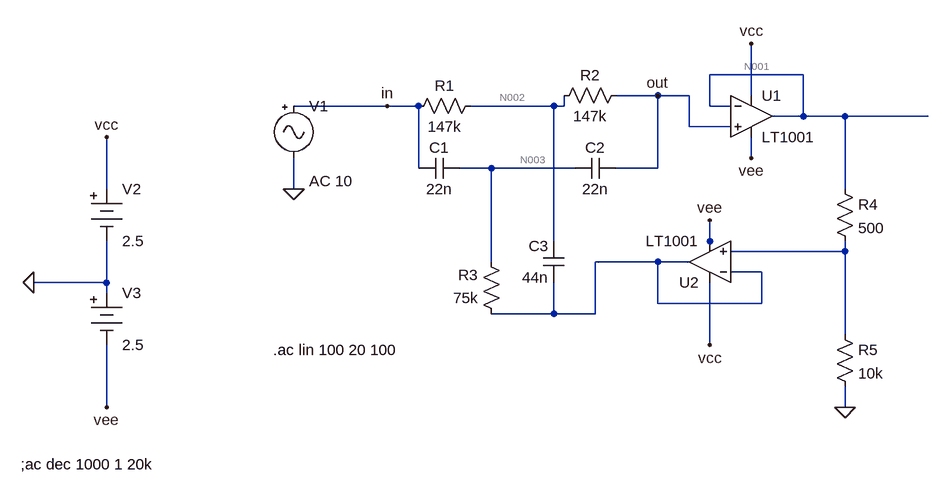
[diagram p0: schematic 50hz_filter.asc]
50hz_filter.asc, the LTspice schematic file:
Version 4
SHEET 1 880 680
WIRE 560 -64 416 -64
WIRE 336 -32 272 -32
WIRE 384 -32 336 -32
WIRE 480 -32 480 -112
WIRE -80 -16 -224 -16
WIRE -32 -16 -80 -16
WIRE 176 -16 48 -16
WIRE 192 -16 192 -32
WIRE 192 -16 176 -16
WIRE 416 -16 416 -64
WIRE 448 -16 416 -16
WIRE 560 0 560 -64
WIRE 560 0 512 0
WIRE 624 0 560 0
WIRE 752 0 624 0
WIRE 384 16 384 -32
WIRE 448 16 384 16
WIRE 480 64 480 32
WIRE -32 80 -32 -16
WIRE 80 80 32 80
WIRE 208 80 80 80
WIRE 336 80 336 -32
WIRE 336 80 272 80
WIRE -512 112 -512 32
WIRE -224 112 -224 64
WIRE 624 112 624 0
WIRE 176 192 176 -16
WIRE 416 192 416 160
WIRE 416 208 416 192
WIRE 624 208 624 192
WIRE 624 208 448 208
WIRE 80 224 80 80
WIRE 336 224 240 224
WIRE 384 224 336 224
WIRE 496 240 448 240
WIRE -512 256 -512 192
WIRE -512 256 -624 256
WIRE -512 272 -512 256
WIRE 336 288 336 224
WIRE 496 288 496 240
WIRE 496 288 336 288
WIRE 176 304 176 256
WIRE 176 304 80 304
WIRE 240 304 240 224
WIRE 240 304 176 304
WIRE 624 336 624 208
WIRE 416 352 416 256
WIRE -512 448 -512 352
WIRE 624 448 624 416
FLAG -224 112 0
FLAG 336 -32 out
FLAG -80 -16 in
FLAG 624 448 0
FLAG -512 32 vcc
FLAG -512 448 vee
FLAG -624 256 0
FLAG 480 -112 vcc
FLAG 416 352 vcc
FLAG 480 64 vee
FLAG 416 160 vee
SYMBOL res 64 -32 R90
WINDOW 0 0 56 VBottom 2
WINDOW 3 32 56 VTop 2
SYMATTR InstName R1
SYMATTR Value 147k
SYMBOL res 288 -48 R90
WINDOW 0 0 56 VBottom 2
WINDOW 3 32 56 VTop 2
SYMATTR InstName R2
SYMATTR Value 147k
SYMBOL res 96 320 R180
WINDOW 0 36 76 Left 2
WINDOW 3 36 40 Left 2
SYMATTR InstName R3
SYMATTR Value 75k
SYMBOL cap 32 64 R90
WINDOW 0 0 32 VBottom 2
WINDOW 3 32 32 VTop 2
SYMATTR InstName C1
SYMATTR Value 22n
SYMBOL cap 272 64 R90
WINDOW 0 0 32 VBottom 2
WINDOW 3 32 32 VTop 2
SYMATTR InstName C2
SYMATTR Value 22n
SYMBOL cap 192 256 R180
WINDOW 0 24 56 Left 2
WINDOW 3 24 8 Left 2
SYMATTR InstName C3
SYMATTR Value 44n
SYMBOL Misc\\signal -224 -32 R0
WINDOW 123 24 132 Left 2
WINDOW 39 0 0 Left 0
SYMATTR Value2 AC 10
SYMATTR InstName V1
SYMATTR Value ""
SYMBOL OpAmps\\LT1001 480 -64 R0
SYMATTR InstName U1
SYMBOL OpAmps\\LT1001 416 288 R180
SYMATTR InstName U2
SYMBOL res 608 96 R0
SYMATTR InstName R4
SYMATTR Value 500
SYMBOL res 608 320 R0
SYMATTR InstName R5
SYMATTR Value 10k
SYMBOL Misc\\battery -512 96 R0
WINDOW 123 0 0 Left 0
WINDOW 39 0 0 Left 0
SYMATTR InstName V2
SYMATTR Value 2.5
SYMBOL Misc\\battery -512 256 R0
WINDOW 123 0 0 Left 0
WINDOW 39 0 0 Left 0
SYMATTR InstName V3
SYMATTR Value 2.5
TEXT -256 360 Left 2 !.ac lin 100 20 100
TEXT -644 536 Left 2 !;ac dec 1000 1 20k

The netlist it stands for:
* 50hz_filter.asc
R1 N002 in 147k
R2 out N002 147k
R3 N005 N003 75k
C1 N003 in 22n
C2 out N003 22n
C3 N005 N002 44n
V1 in 0 AC 10
XU1 out N001 vcc vee N001 LT1001  ; pins In+ In- V+ V- OUT
XU2 N004 N005 vcc vee N005 LT1001  ; pins In+ In- V+ V- OUT
R4 N001 N004 500
R5 N004 0 10k
V2 vcc 0 2.5
V3 0 vee 2.5
.ac lin 100 20 100
;ac dec 1000 1 20k
.lib LTC.lib
.backanno
.end

* Results of the author's LTspice run, read from the files saved beside the schematic
* Operating Point, zero values left out:
*   V(vcc) = 2.5 V
*   V(vee) = -2.5 V
*   I(V3) = -4.5 mA
*   I(V2) = -4.5 mA
*   Ix(u1:3) = 2.25 mA
*   Ix(u1:4) = -2.25 mA
*   Ix(u2:3) = 2.25 mA
*   Ix(u2:4) = -2.25 mA
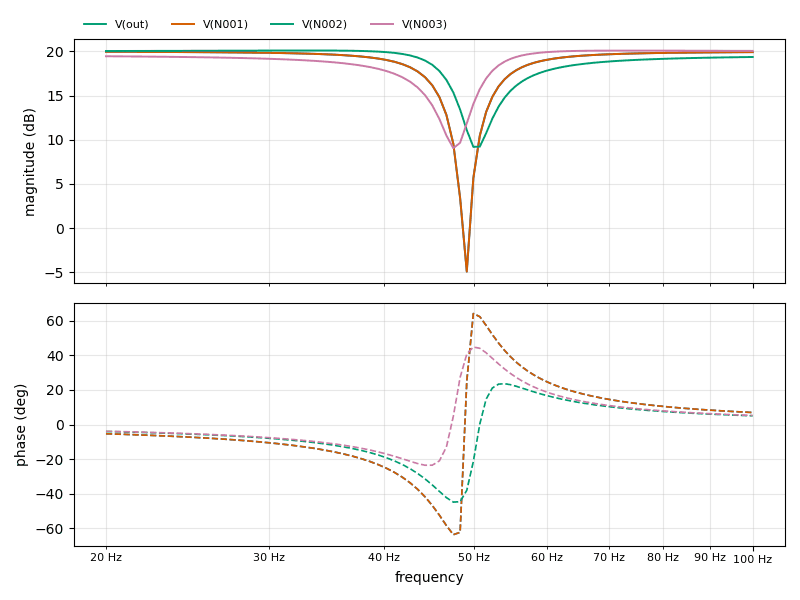
[diagram p1: AC Analysis of 50hz_filter.asc, plotted from the saved traces]
* AC Analysis, 1 run:
*   V(out): 19.96 dB at 20 Hz, 19.92 dB at 100 Hz, peak 19.96 dB at 20 Hz, 3 dB below the peak at 44.36 Hz
*   V(N001): 19.96 dB at 20 Hz, 19.92 dB at 100 Hz, peak 19.96 dB at 20 Hz, 3 dB below the peak at 44.36 Hz
*   V(N002): 20.05 dB at 20 Hz, 19.37 dB at 100 Hz, peak 20.10 dB at 32.93 Hz, 3 dB below the peak at 46.41 Hz
*   V(N003): 19.45 dB at 20 Hz, 20.06 dB at 100 Hz, peak 20.10 dB at 73.33 Hz, 3 dB below the peak at 51.64 Hz